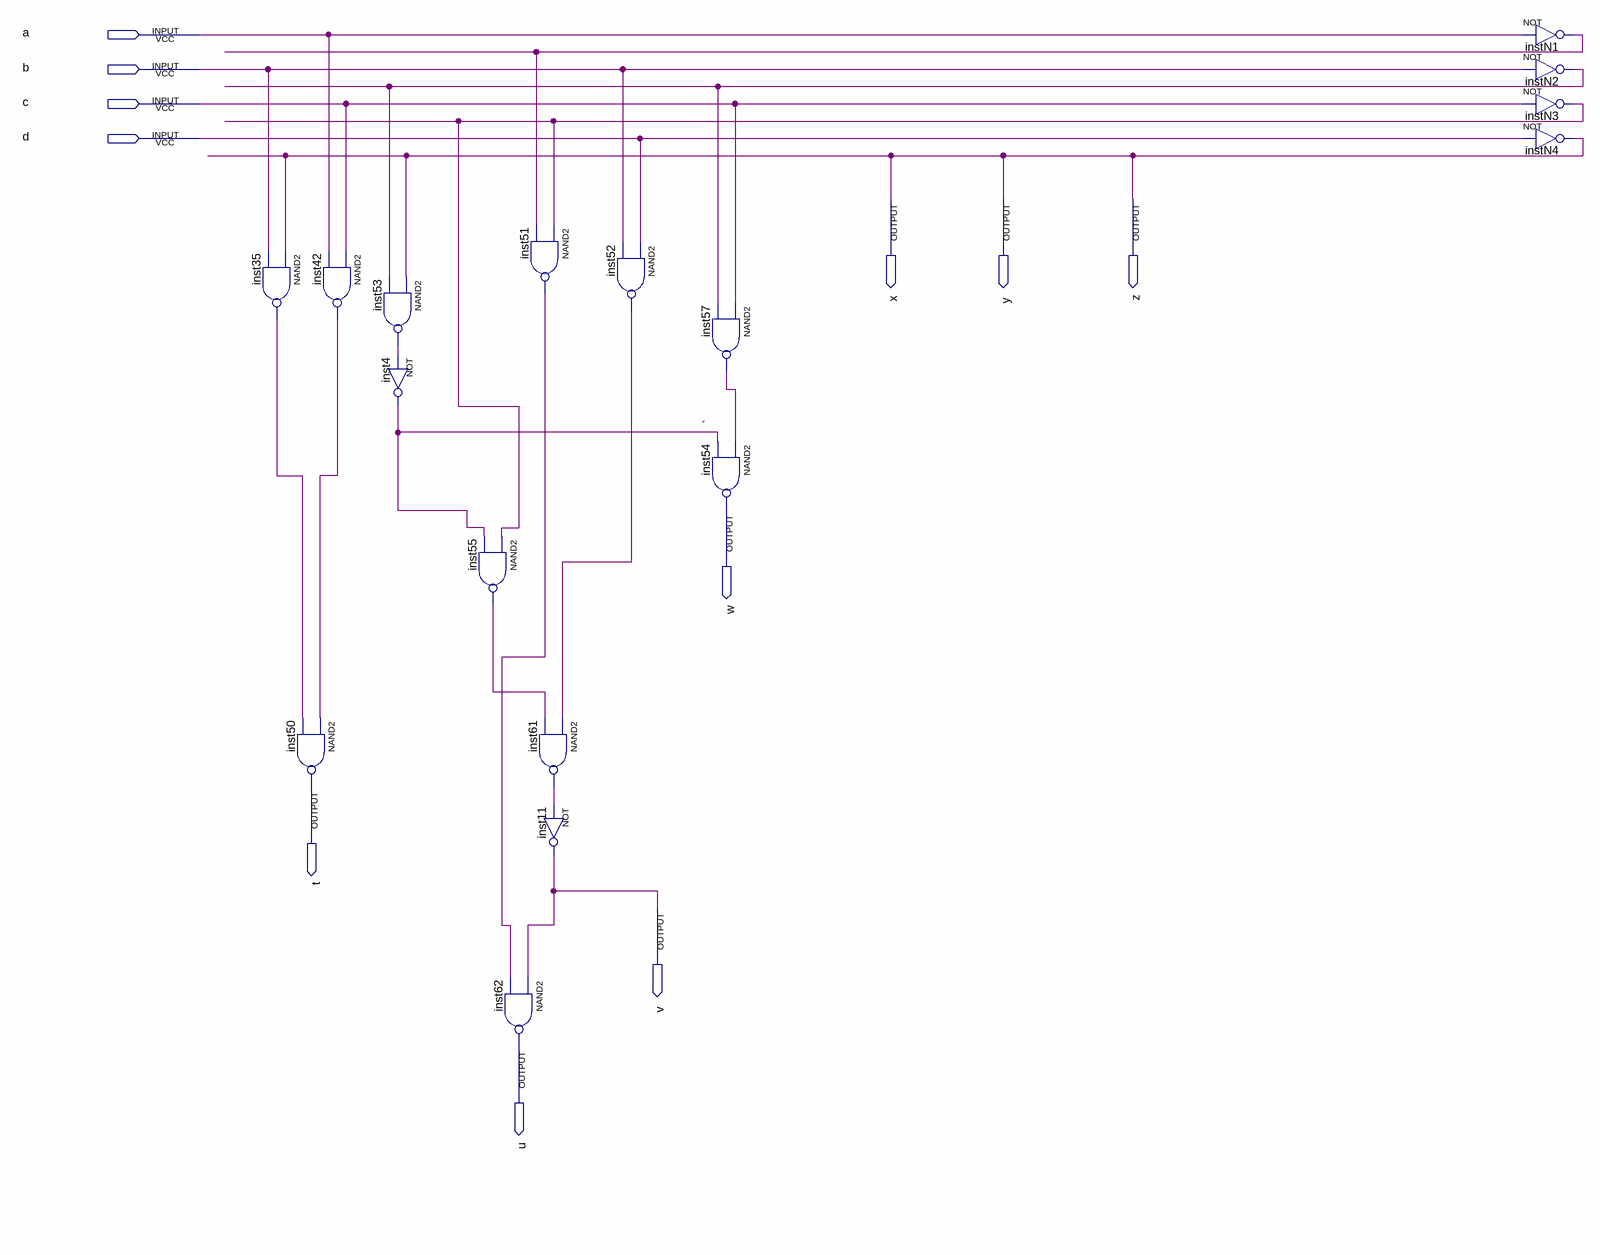
[diagram p0: schematic sheet]
// Quartus schematic BCD_gate_level_reference.bdf as structural Verilog: 17 symbols, 11 pins
module BCD_gate_level_reference (
  input  a,
  input  b,
  input  c,
  input  d,
  output x,
  output y,
  output z,
  output w,
  output t,
  output v,
  output u
);

  wire \` , inst35_out, inst42_out, inst51_out, inst52_out, inst53_out, inst55_out, inst57_out, inst61_out,
       instN1_out, instN2_out, instN3_out;

  nand inst35 (inst35_out, x, b);
  nand inst42 (inst42_out, c, a);
  nand inst50 (t, inst42_out, inst35_out);
  nand inst53 (inst53_out, x, instN2_out);
  not inst4 (\` , inst53_out);
  nand inst55 (inst55_out, instN3_out, \` );
  nand inst51 (inst51_out, instN3_out, instN1_out);
  nand inst61 (inst61_out, inst52_out, inst55_out);
  not inst11 (v, inst61_out);
  nand inst62 (u, v, inst51_out);
  nand inst52 (inst52_out, d, b);
  nand inst57 (inst57_out, c, instN2_out);
  nand inst54 (w, inst57_out, \` );
  not instN1 (instN1_out, a);
  not instN2 (instN2_out, b);
  not instN3 (instN3_out, c);
  not instN4 (x, d);

  assign y = x;
  assign z = x;
endmodule
